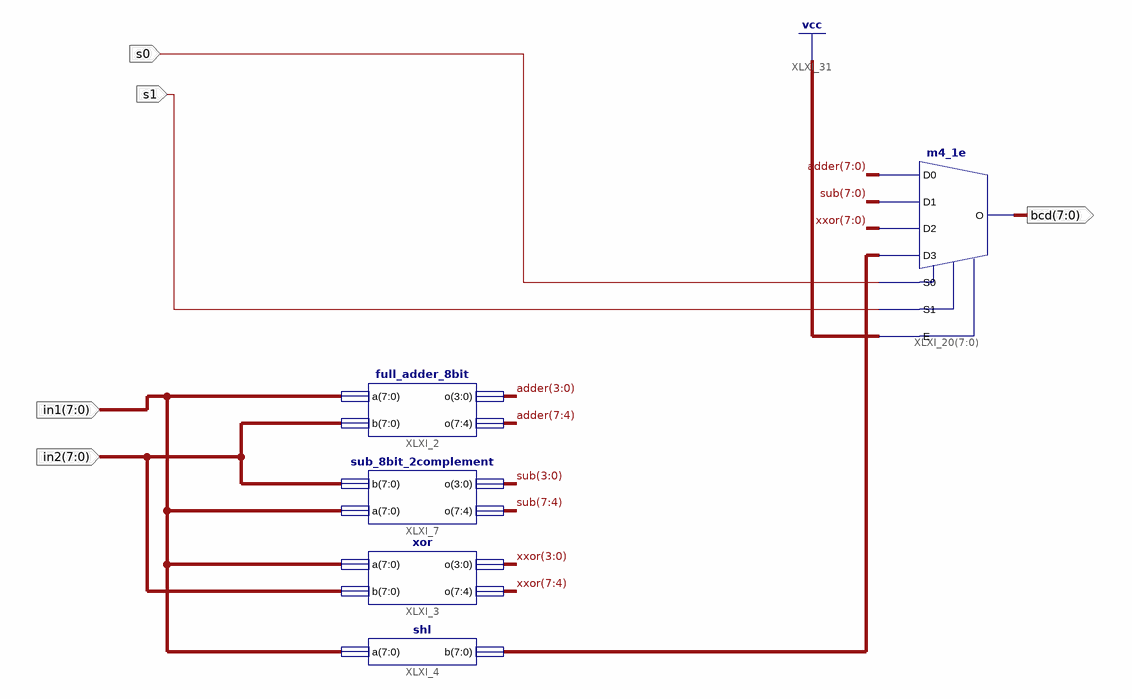
[diagram p0: schematic sheet 1]
// Xilinx ISE schematic alu.sch (spartan6) as structural Verilog: 5 symbols, 5 ports
module alu (
  input  [7:0] in1,
  input  [7:0] in2,
  input  s0,
  input  s1,
  output [7:0] bcd
);

  wire [7:0] adder, shiff, sub, xxor;

  full_adder_8bit XLXI_2 (.a(in1), .b(in2), .o(adder));
  sub_8bit_2complement XLXI_7 (.b(in2), .a(in1), .o(sub));
  \xor  XLXI_3 (.a(in1), .b(in2), .o(xxor));
  shl XLXI_4 (.a(in1), .b(shiff));
  m4_1e XLXI_20[7:0] (.D0(adder), .D1(sub), .D2(xxor), .D3(shiff), .E({8{1'b1}}), .S0(s0), .S1(s1), .O(bcd));
endmodule
